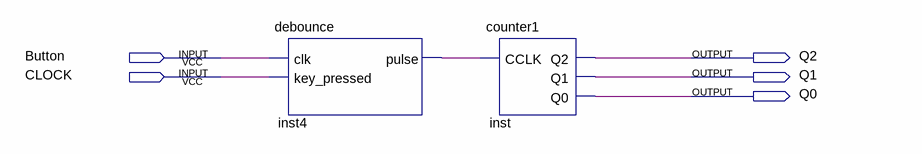
[diagram p0: schematic sheet]
// Quartus schematic test1.bdf as structural Verilog: 2 symbols, 5 pins
module test1 (
  input  Button,
  input  CLOCK,
  output Q2,
  output Q1,
  output Q0
);

  wire inst4_pulse;

  debounce inst4 (.clk(Button), .key_pressed(CLOCK), .pulse(inst4_pulse));
  counter1 inst (.CCLK(inst4_pulse), .Q2(Q2), .Q1(Q1), .Q0(Q0));
endmodule
